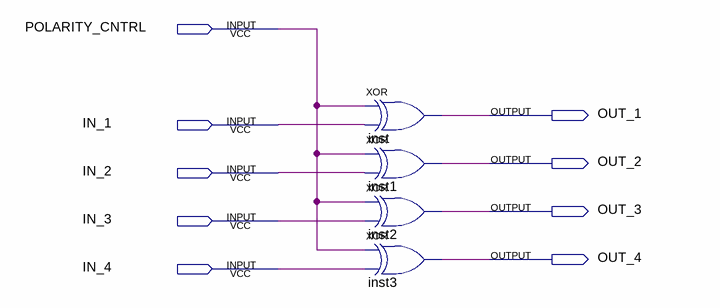
[diagram p0: schematic sheet]
// Quartus schematic schem_polar.bdf as structural Verilog: 4 symbols, 9 pins
module schem_polar (
  input  POLARITY_CNTRL,
  input  IN_1,
  input  IN_2,
  input  IN_3,
  input  IN_4,
  output OUT_1,
  output OUT_2,
  output OUT_3,
  output OUT_4
);

  xor inst (OUT_1, POLARITY_CNTRL, IN_1);
  xor inst1 (OUT_2, POLARITY_CNTRL, IN_2);
  xor inst2 (OUT_3, POLARITY_CNTRL, IN_3);
  xor inst3 (OUT_4, POLARITY_CNTRL, IN_4);
endmodule
